# EAGLE design HACKberry_SizeM_Right (EAGLE 8.4.0)

## Sheet 1 of 5: Power Supply
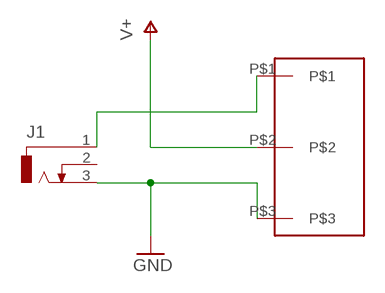
[diagram p0: schematic, sheet 1]

### Parts
J1  DCJ0303  [DCJ0303]
U$2  SS-12D00  [SS-12D00]

### Nets
GND: J1.3 U$2.P$3 ; also sheet 2,3,4,5
N$1: J1.1 U$2.P$1
V+: U$2.P$2 ; also sheet 2
Unconnected: J1.2

## Sheet 2 of 5: DC-DC Converter
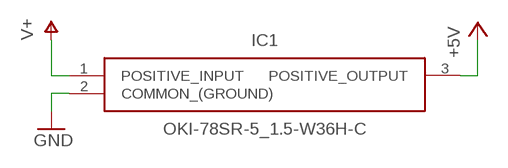
[diagram p1: schematic, sheet 2]

### Parts
IC1  OKI-78SR-5_1.5-W36H-C  [OKI-78SR-HORIZONTAL]

### Nets
+5V: IC1.3(POSITIVE_OUTPUT) ; also sheet 4,5
GND: IC1.2(COMMON_(GROUND)) ; also sheet 1,3,4,5
V+: IC1.1(POSITIVE_INPUT) ; also sheet 1

## Sheet 3 of 5: Buttons
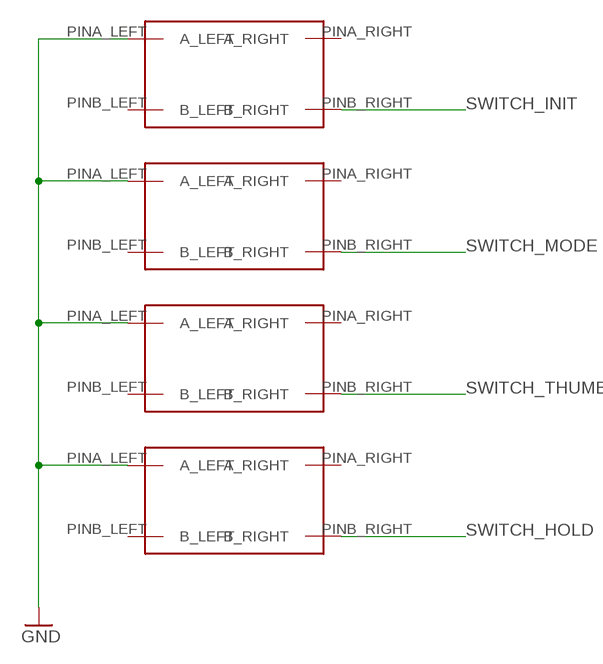
[diagram p2: schematic, sheet 3]

### Parts
U$1  SKRPACE010  [SKRPACE010]
U$3  SKRPACE010  [SKRPACE010]
U$4  SKRPACE010  [SKRPACE010]
U$5  SKRPACE010  [SKRPACE010]

### Nets
GND: U$1.PINA_LEFT(A_LEFT) U$3.PINA_LEFT(A_LEFT) U$4.PINA_LEFT(A_LEFT) U$5.PINA_LEFT(A_LEFT) ; also sheet 1,2,4,5
SWITCH_HOLD: U$5.PINB_RIGHT(B_RIGHT) ; also sheet 5
SWITCH_INIT: U$1.PINB_RIGHT(B_RIGHT) ; also sheet 5
SWITCH_MODE: U$3.PINB_RIGHT(B_RIGHT) ; also sheet 5
SWITCH_THUMB: U$4.PINB_RIGHT(B_RIGHT) ; also sheet 5
Unconnected: U$1.PINA_RIGHT(A_RIGHT) U$1.PINB_LEFT(B_LEFT) U$3.PINA_RIGHT(A_RIGHT) U$3.PINB_LEFT(B_LEFT) U$4.PINA_RIGHT(A_RIGHT) U$4.PINB_LEFT(B_LEFT) U$5.PINA_RIGHT(A_RIGHT) U$5.PINB_LEFT(B_LEFT)

## Sheet 4 of 5: ServoMotor
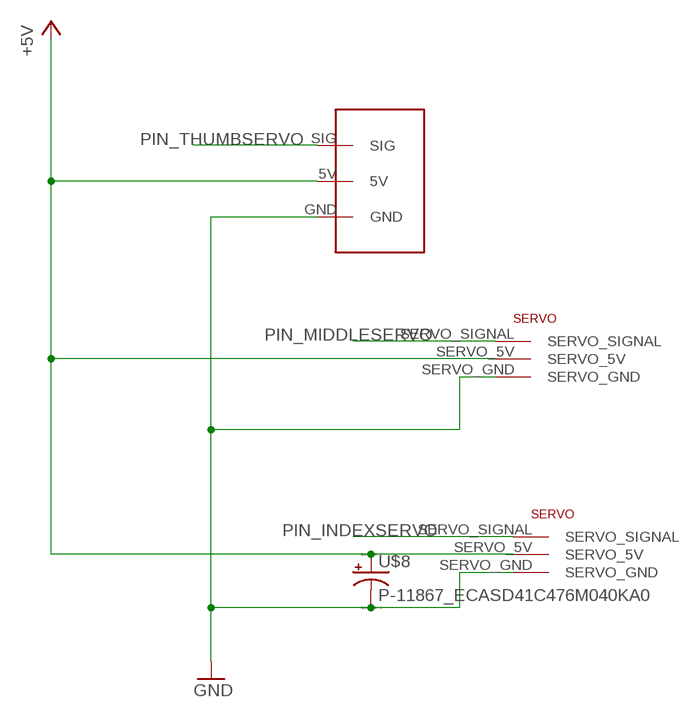
[diagram p3: schematic, sheet 4]

### Parts
INDEXPIN  NN_SERVO  [NN_SERVO]
MIDDLEPIN  NN_SERVO  [NN_SERVO]
THUMBPIN  53047-0310_SERVO  [53047-0310_SERVO]
U$8  P-11867_ECASD41C476M040KA0  [ECASD41C476M040KA0]

### Nets
+5V: INDEXPIN.SERVO_5V MIDDLEPIN.SERVO_5V THUMBPIN.5V U$8.+ ; also sheet 2,5
GND: INDEXPIN.SERVO_GND MIDDLEPIN.SERVO_GND THUMBPIN.GND U$8.- ; also sheet 1,2,3,5
PIN_INDEXSERVO: INDEXPIN.SERVO_SIGNAL ; also sheet 5
PIN_MIDDLESERVO: MIDDLEPIN.SERVO_SIGNAL ; also sheet 5
PIN_THUMBSERVO: THUMBPIN.SIG ; also sheet 5

## Sheet 5 of 5
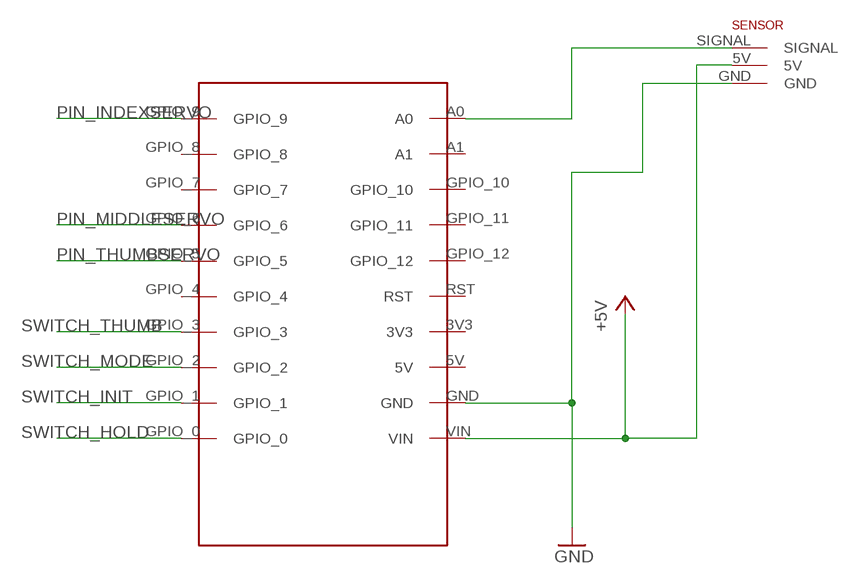
[diagram p4: schematic, sheet 5]

### Parts
U$6  POLOLU_A_STAR_32U4_MICRO  [POLOLU_A_STAR_32U4_MICRO]
U$7  NN_SENSOR  [NN_SENSOR]

### Nets
+5V: U$6.VIN U$7.5V ; also sheet 2,4
GND: U$6.GND U$7.GND ; also sheet 1,2,3,4
N$11: U$6.A0 U$7.SIGNAL
PIN_INDEXSERVO: U$6.GPIO_9 ; also sheet 4
PIN_MIDDLESERVO: U$6.GPIO_6 ; also sheet 4
PIN_THUMBSERVO: U$6.GPIO_5 ; also sheet 4
SWITCH_HOLD: U$6.GPIO_0 ; also sheet 3
SWITCH_INIT: U$6.GPIO_1 ; also sheet 3
SWITCH_MODE: U$6.GPIO_2 ; also sheet 3
SWITCH_THUMB: U$6.GPIO_3 ; also sheet 3
Unconnected: U$6.3V3 U$6.5V U$6.A1 U$6.GPIO_4 U$6.GPIO_7 U$6.GPIO_8 U$6.GPIO_10 U$6.GPIO_11 U$6.GPIO_12 U$6.RST

## Library data of the parts
IC1 = HbHandBoard_SizeM:OKI-78SR-5_1.5-W36H-C: Switching Regulator 7-36Vin 5Vo 1.5A Non-Isolated DC-DC Converter, 5V dc Output, 1.5A <https://componentsearchengine.com/Images/1/OKI-78SR-5_1.5-W36H-C.jpg> Source: Datasheet <http://www.mouser.com/ds/2/281/oki-78sr-56393.pdf>; DESCRIPTION: Switching Regulator 7-36Vin 5Vo 1.5A Non-Isolated DC-DC Converter, 5V dc Output, 1.5A; HEIGHT: mm; MANUFACTURER_NAME: Murata Electronics; MANUFACTURER_PART_NUMBER: OKI-78SR-5/1.5-W36H-C; RS_PART_NUMBER: 7962138P; SUPPLIER_NAME: RS
INDEXPIN MIDDLEPIN = HbHandBoard_SizeM:NN_SERVO
J1 = HbHandBoard_SizeM:DCJ0303: DC POWER JACK Source: DCJ0303.pdf
THUMBPIN = HbHandBoard_SizeM:53047-0310_SERVO
U$1 U$3-U$5 = HbHandBoard_SizeM:SKRPACE010
U$2 = HbHandBoard_SizeM:SS-12D00
U$6 = HbHandBoard_SizeM:POLOLU_A_STAR_32U4_MICRO
U$7 = HbHandBoard_SizeM:NN_SENSOR
U$8 = Akizuki:P-11867_ECASD41C476M040KA0

## Board
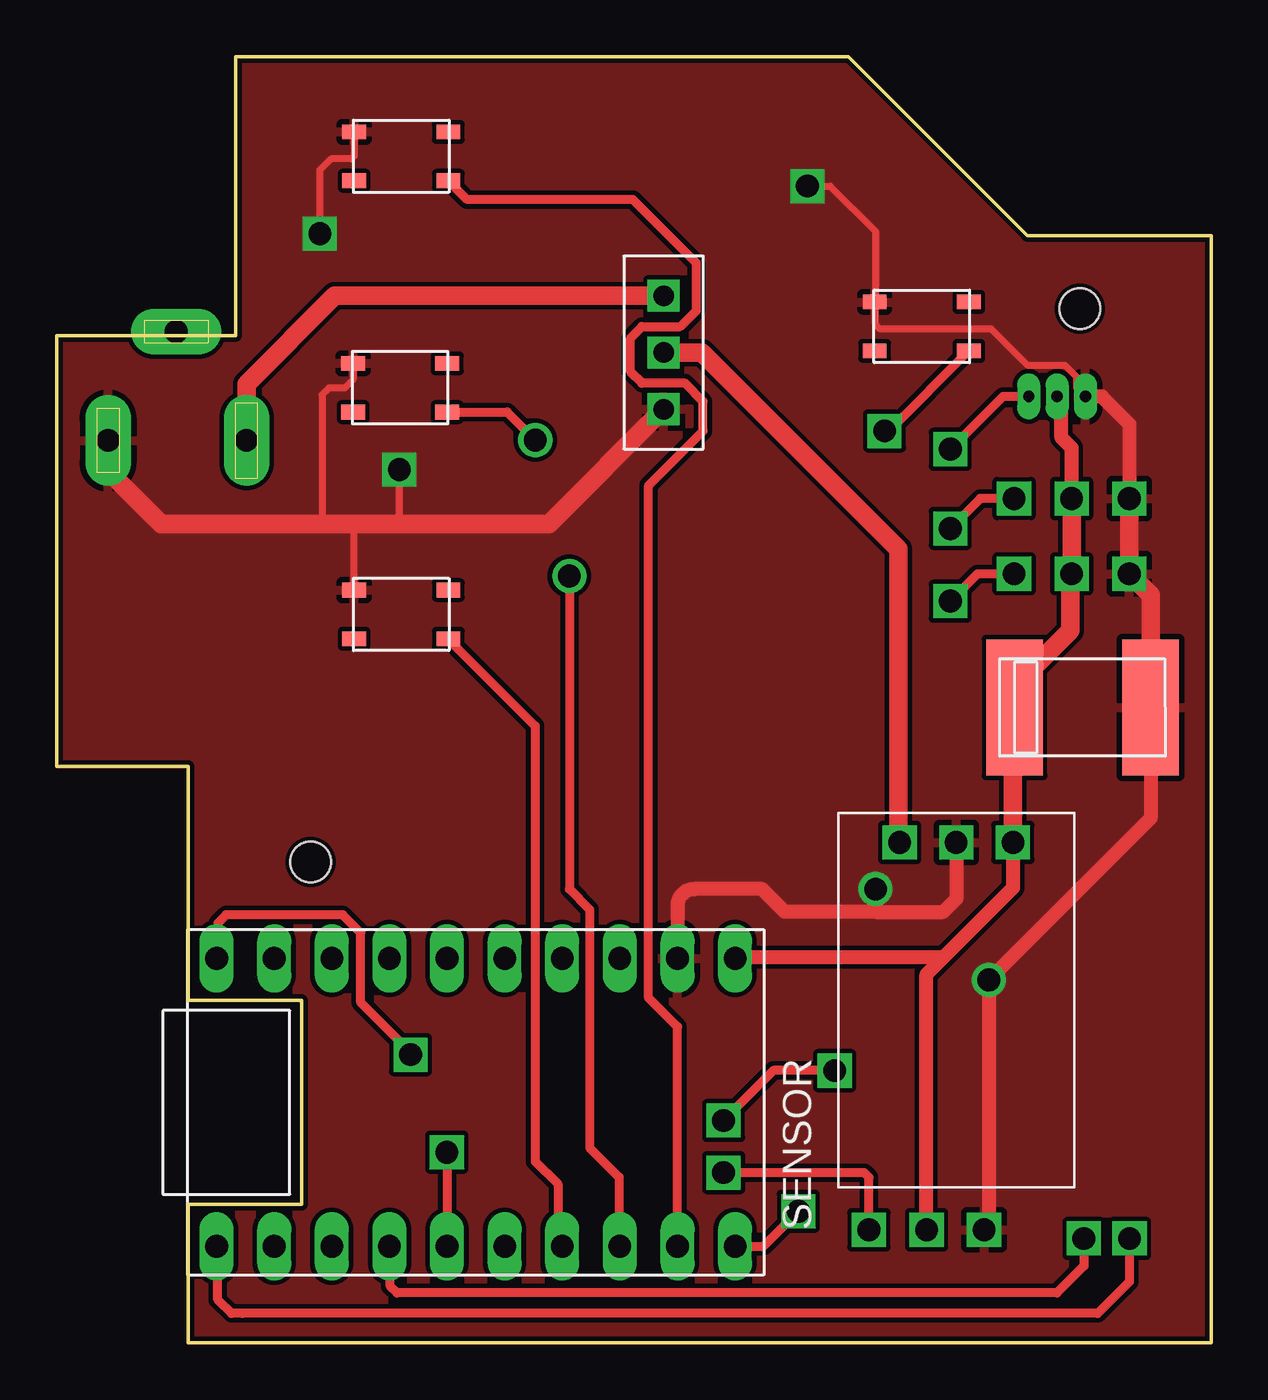
[diagram p5: board, top side]
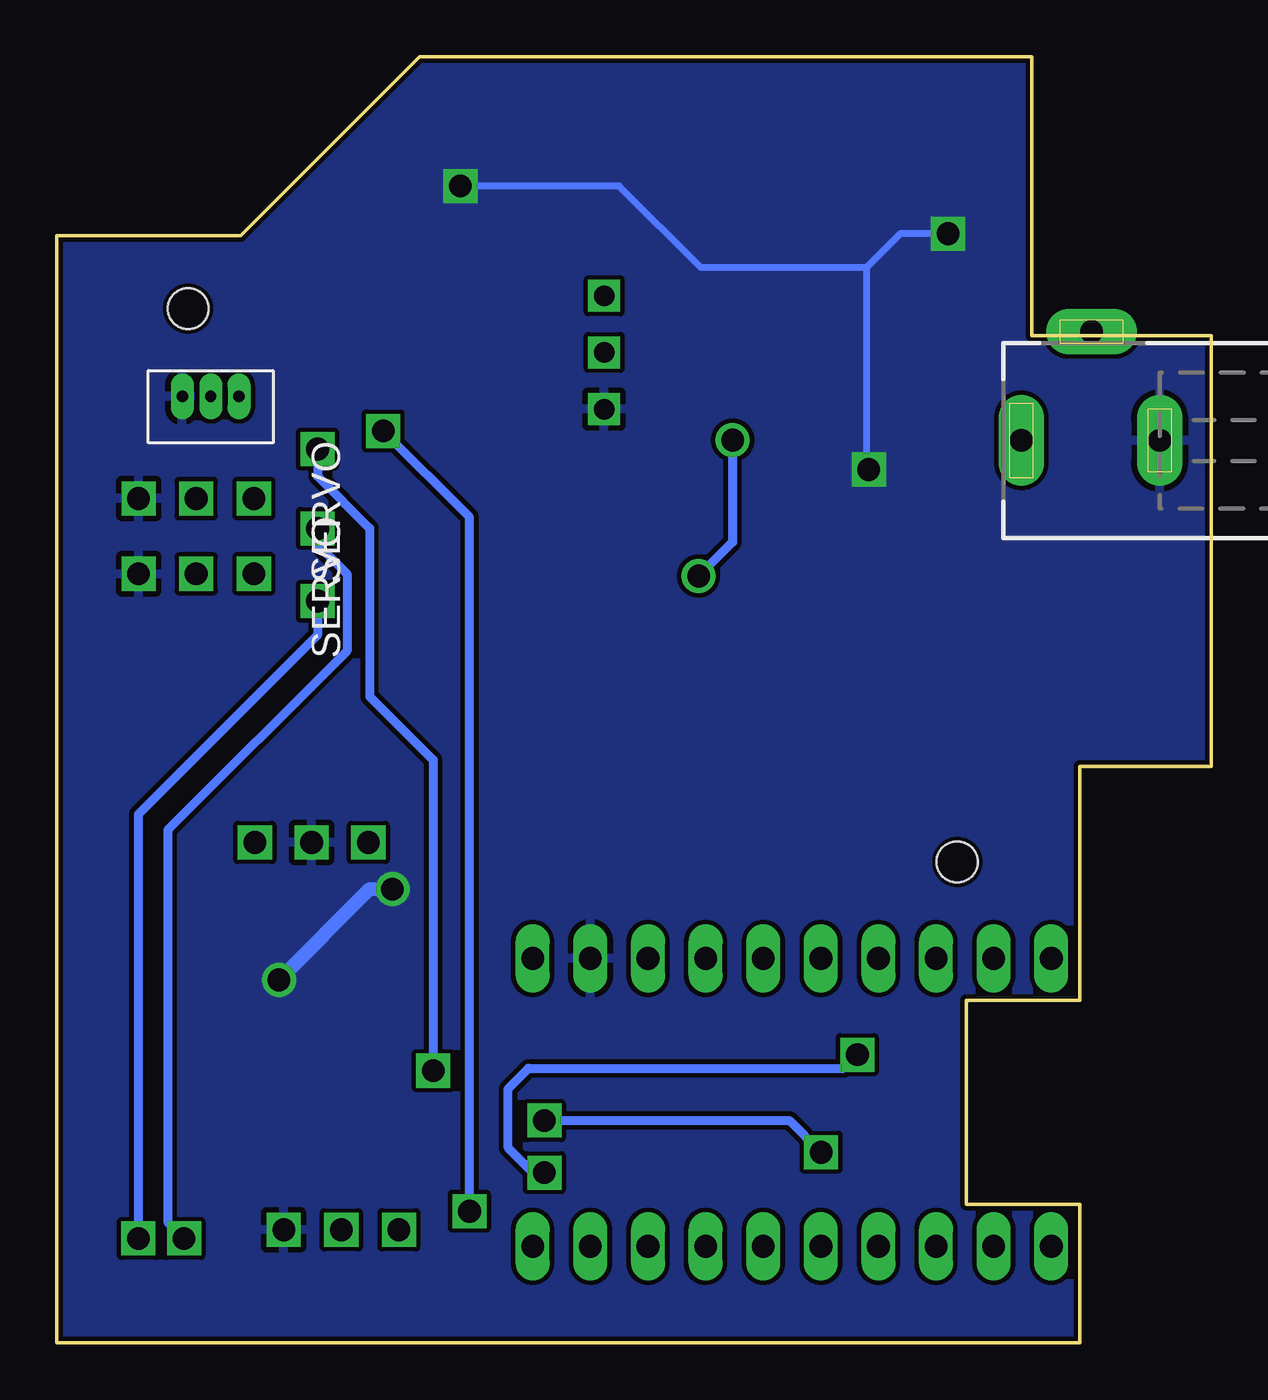
[diagram p6: board, bottom side, seen from below]

Size 50.9 x 56.7 mm. Coordinates in mm from the lower left corner, seen from the top.
Outline: 0,25.4 5.8,25.4 5.8,15.1 10.8,15.1 10.8,6.1 5.8,6.1 5.8,0 50.9,0 50.9,48.8 42.8,48.8 34.9,56.7 7.9,56.7 7.9,44.4 0,44.4 0,25.4
Copper layers (1*16): Top 0.035mm / dielectric 1.5mm / Bottom 0.035mm
Design rules "default *": minimum track width 6mil, minimum drill 0.35mm, track to track 8mil, track to pad 8mil, pad to pad 8mil, via to via 8mil, smd to smd 8mil, copper to edge 8mil, drill to drill 8mil, minimum pad ring 10mil, minimum via ring 8mil, stop-mask expansion 4mil, vias tented up to drill 0mil, thermal gap 10mil
Holes 1.8 mm at 11.2,21.2 45.1,45.6

### Footprints (pad centres in the part's own frame; a part is rotated, then mirrored left to right if it is on the bottom)
OKI-78SR-HORIZONTAL = drill 1 square: 1 2.5,-6.95; 2 0,-6.95; 3 -2.5,-6.95
NN_SERVO = drill 1 square: SERVO_5V 0,0; SERVO_GND 0,-2.54; SERVO_SIGNAL 0,2.54
DCJ0303 = drill 1 pad 2 long: 1 0,3.1; 2 4.8,0; 3 0,-3
53047-0310_SERVO = drill 0.5 long: 5V 0,0; GND 0,-1.25; SIG 0,1.25
SKRPACE010 = smd 1.05 x 0.65: PINA_LEFT -2.075,1.075; PINA_RIGHT 2.075,1.075; PINB_LEFT -2.075,-1.075; PINB_RIGHT 2.075,-1.075
SS-12D00 = drill 0.9 square: P$1 0,2.5; P$2 0,0; P$3 0,-2.5
POLOLU_A_STAR_32U4_MICRO = drill 1 long: 3V3 6.35,-3.81; 5V 6.35,-6.35; A0 6.35,11.43; A1 6.35,8.89; GND 6.35,-8.89; GPIO_0 -6.35,-11.43; GPIO_1 -6.35,-8.89; GPIO_2 -6.35,-6.35; GPIO_3 -6.35,-3.81; GPIO_4 -6.35,-1.27; GPIO_5 -6.35,1.27; GPIO_6 -6.35,3.81; GPIO_7 -6.35,6.35; GPIO_8 -6.35,8.89; GPIO_9 -6.35,11.43; GPIO_10 6.35,6.35; GPIO_11 6.35,3.81; GPIO_12 6.35,1.27; RST 6.35,-1.27; VIN 6.35,-11.43
NN_SENSOR = drill 1 square: 5V 0,0; GND 0,-2.54; SIGNAL 0,2.54
ECASD41C476M040KA0 = smd 2.5 x 6: + 3,0; - -3,0

### Placement (x,y rotation side)
IC1  39.66,15.11 180 top
INDEXPIN  44.75,33.9 270 bottom
J1  5.27,39.78 90 bottom
MIDDLEPIN  44.75,37.22 270 bottom
THUMBPIN  44.11,41.72 270 bottom
U$1  15.19,52.31 0 top
U$2  26.76,43.66 0 top
U$3  15.14,42.11 0 top
U$4  15.19,32.11 0 top
U$5  38.14,44.81 0 top
U$6  18.48,10.6 90 top
U$7  38.35,4.98 90 top
U$8  45.23,28.01 180 top

### Tracks (layer width: path | path; a pad name or v marks a point on that pad's centre or on a via)
+5V
  Top 0.61: MIDDLEPIN.SERVO_5V 44.75,39.45 44.3,39.9 44.3,41.53 THUMBPIN.5V | IC1.3 42.16,20.06 39.1,17 | U$6.VIN arc-90 29.96,17 39.1,17 | U$7.5V 38.35,16.25 39.1,17
  Top 0.813: IC1.3 42.16,27.94 U$8.+ 42.23,28.93 44.7,31.4 44.7,33.85 INDEXPIN.SERVO_5V MIDDLEPIN.SERVO_5V
GND  (via drill 1 pad 1.5)
  Top 0.305: U$4.PINA_LEFT 13.12,36.09 13.1,36.1 | U$3.PINA_LEFT 13.06,42.47 12.7,42.1 12,42.1 11.7,41.8 11.7,36.2 11.6,36.1 | U$1.PINA_LEFT 13.12,52.31 13,52.2 12.1,52.2 11.6,51.7 v11.6,48.9 | v15.1,38.5 15.1,36.5 14.7,36.1 | v33.1,51 34.1,51 36.1,49 36.1,45.92 U$5.PINA_LEFT 36.1,45.85 36.1,44.9 36.3,44.7 41.2,44.7 42.82,43.08 44.47,43.08 44.97,42.58 44.97,42.11 THUMBPIN.GND
  Top 0.61: THUMBPIN.GND 46.08,41.72 47.3,40.5 MIDDLEPIN.SERVO_GND | IC1.2 39.66,19.56 39.1,19 36.1,19 | 36.1,19 32.1,19 31.1,20 28.1,20 arc90 27.37,19.27 U$6.GND | U$8.- 48.23,23.13 v41.1,16 41.1,5.19 U$7.GND | v36.1,20 36.1,19
  Top 0.813: J1.3 2.27,38.43 4.6,36.1 11.6,36.1 13.1,36.1 14.7,36.1 21.7,36.1 U$2.P$3 | U$8.- 48.23,32.96 INDEXPIN.SERVO_GND MIDDLEPIN.SERVO_GND
  Bottom 0.305: v11.6,48.9 13.7,48.9 15.2,47.4 | 15.2,47.4 15.2,38.6 v15.1,38.5 | 15.2,47.4 22.5,47.4 26.1,51 v33.1,51
  Bottom 0.61: v41.1,16 37.1,20 v36.1,20
  pour Top: 0,44.4 0,25.4 5.8,25.4 5.8,15.1 10.8,15.1 10.8,6.1 5.8,6.1 5.8,0 50.9,0 50.9,48.8 42.8,48.8 34.9,56.7 7.9,56.7 7.9,44.4
  pour Bottom: 0,44.4 0,25.4 5.8,25.4 5.8,15.1 10.8,15.1 10.8,6.1 5.8,6.1 5.8,0 50.9,0 50.9,48.8 42.8,48.8 34.9,56.7 7.9,56.7 7.9,44.4
N$1
  Top 0.813: J1.1 8.37,42.27 12.26,46.16 U$2.P$1
N$11  (via drill 1 pad 1.5)
  Top 0.406: U$7.SIGNAL 35.81,7.29 35.6,7.5 v29.4,7.5 | v15.6,12.7 15.6,12.8 13.4,15 13.4,18.07 12.61,18.86 7.46,18.86 7.1,18.5 7.1,17 U$6.A0
  Bottom 0.406: v29.4,7.5 29.9,7.5 31,8.6 31,11.2 30.1,12.1 16.2,12.1 v15.6,12.7
PIN_INDEXSERVO  (via drill 1 pad 1.5)
  Top 0.406: INDEXPIN.SERVO_SIGNAL 40.6,33.9 v39.4,32.7 | v47.3,4.6 47.3,2.7 45.9,1.29 8.2,1.29 7.71,1.29 7.1,1.9 7.1,4.2 U$6.GPIO_9
  Bottom 0.406: v39.4,32.7 39.4,31.2 47.3,23.3 v47.3,4.6
PIN_MIDDLESERVO  (via drill 1 pad 1.5)
  Top 0.406: MIDDLEPIN.SERVO_SIGNAL 40.72,37.22 v39.4,35.9 | v45.29,4.6 45.29,3.39 44.1,2.2 15,2.2 14.7,2.5 14.7,4.22 U$6.GPIO_6
  Bottom 0.406: v39.4,35.9 39.4,35.2 38.1,33.9 38.1,30.5 46,22.6 46,5.31 v45.29,4.6
PIN_THUMBSERVO  (via drill 1 pad 1.5)
  Top 0.406: THUMBPIN.SIG 41.72,41.72 v39.4,39.4 | v34.3,12 31.6,12 v29.4,9.8 | v17.2,8.4 U$6.GPIO_5
  Bottom 0.406: v39.4,39.4 39.4,38.2 37.1,35.9 37.1,28.5 34.3,25.7 v34.3,12 | v29.4,9.8 18.6,9.8 v17.2,8.4
SWITCH_HOLD  (via drill 1 pad 1.5)
  Top 0.406: U$6.GPIO_0 31.15,4.25 v32.7,5.8 | v36.5,40.2 36.68,40.2 U$5.PINB_RIGHT
  Bottom 0.406: v32.7,5.8 32.7,36.4 v36.5,40.2
SWITCH_INIT
  Top 0.406: U$6.GPIO_1 27.37,13.93 26.1,15.2 26.1,37.8 28.5,40.2 28.5,41.5 27.7,42.3 25.8,42.3 25.3,42.8 25.3,44.3 25.8,44.8 27.5,44.8 28.2,45.5 28.2,47.6 25.4,50.4 18.1,50.4 U$1.PINB_RIGHT
SWITCH_MODE  (via drill 1 pad 1.5)
  Top 0.406: U$3.PINB_RIGHT 19.87,41.03 v21.1,39.8 | v22.6,33.8 22.6,20 23.5,19.1 23.5,8.6 24.8,7.3 24.8,4.28 U$6.GPIO_2
  Bottom 0.406: v21.1,39.8 21.1,35.3 v22.6,33.8
SWITCH_THUMB
  Top 0.406: U$4.PINB_RIGHT 21.1,27.2 21.1,8 22.1,7 22.1,4.44 U$6.GPIO_3
V+
  Top 0.813: U$2.P$2 28.44,43.66 37.1,35 37.1,22.12 IC1.1